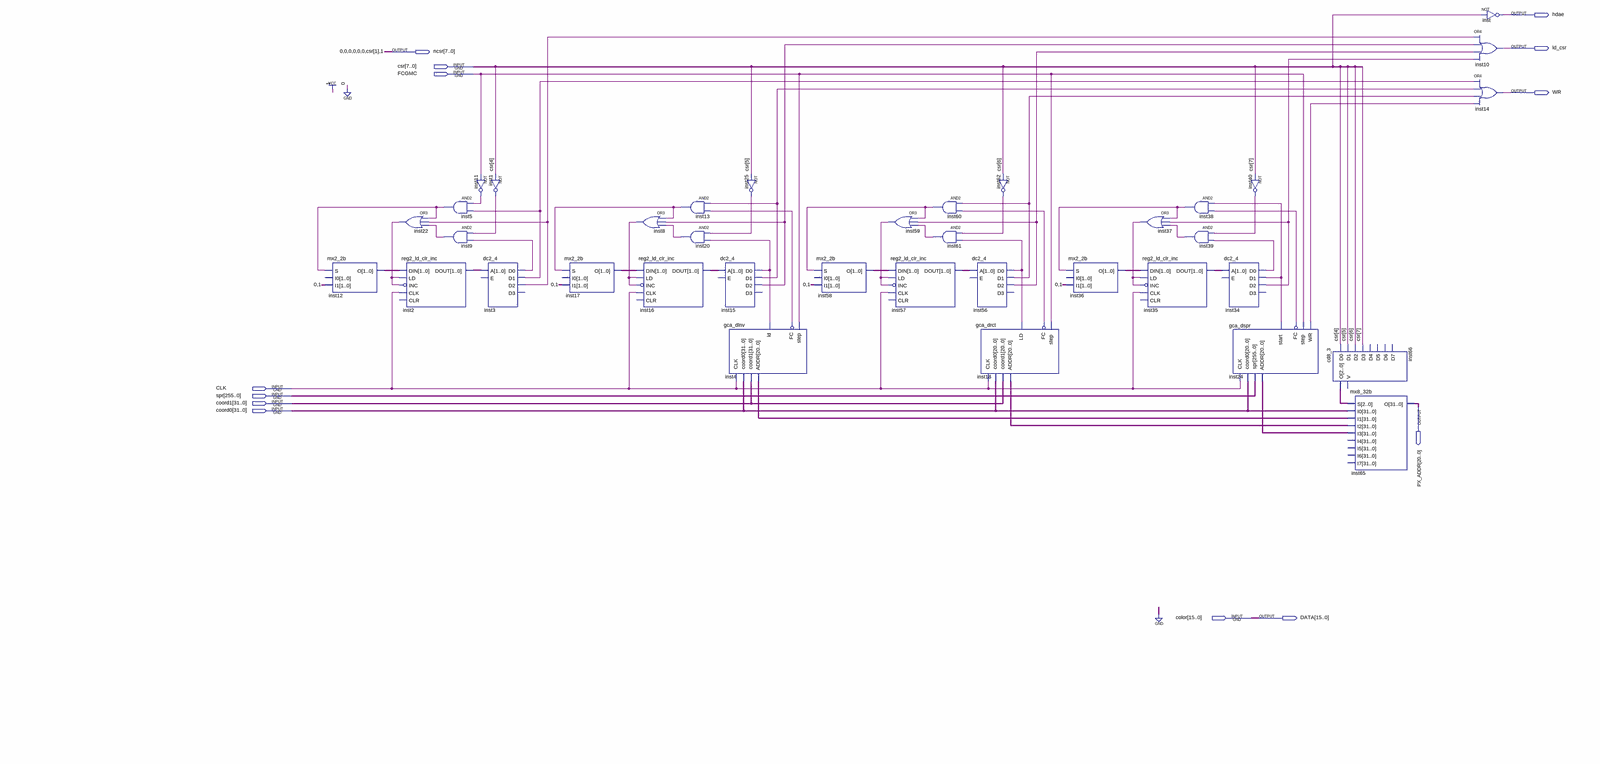
[diagram p0: schematic sheet, whole]
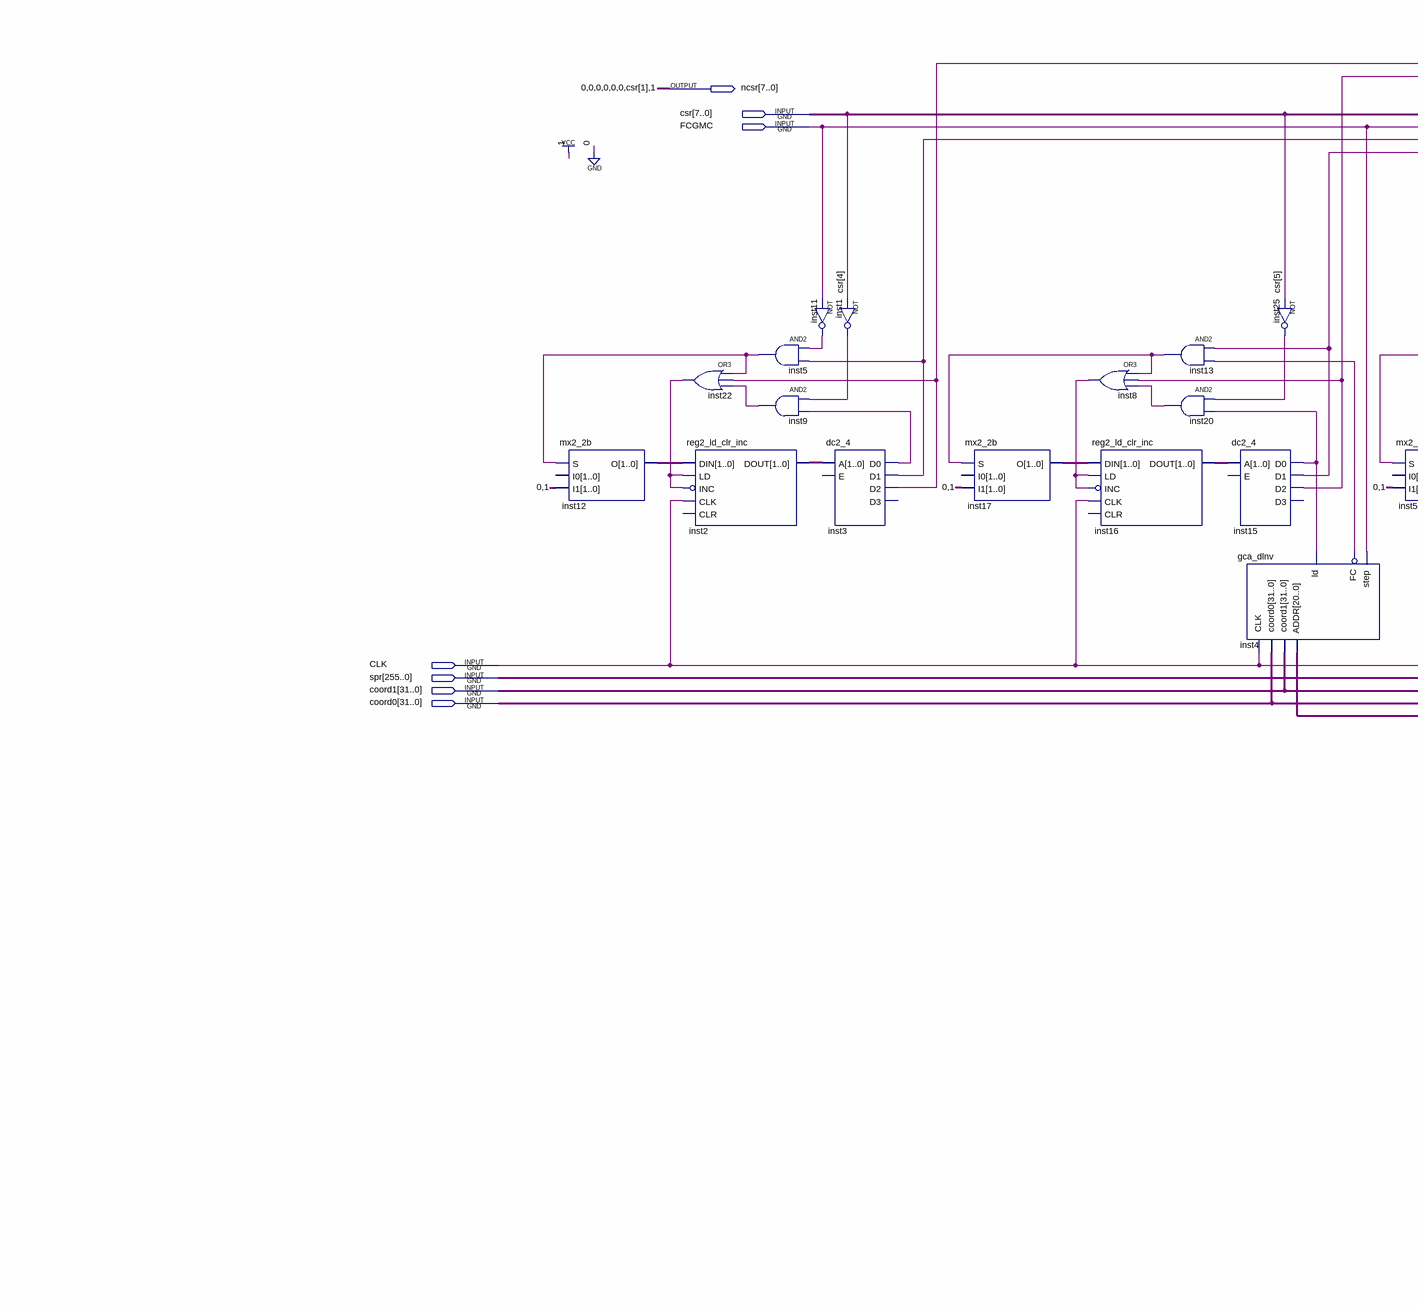
[diagram p1: schematic sheet, left part]
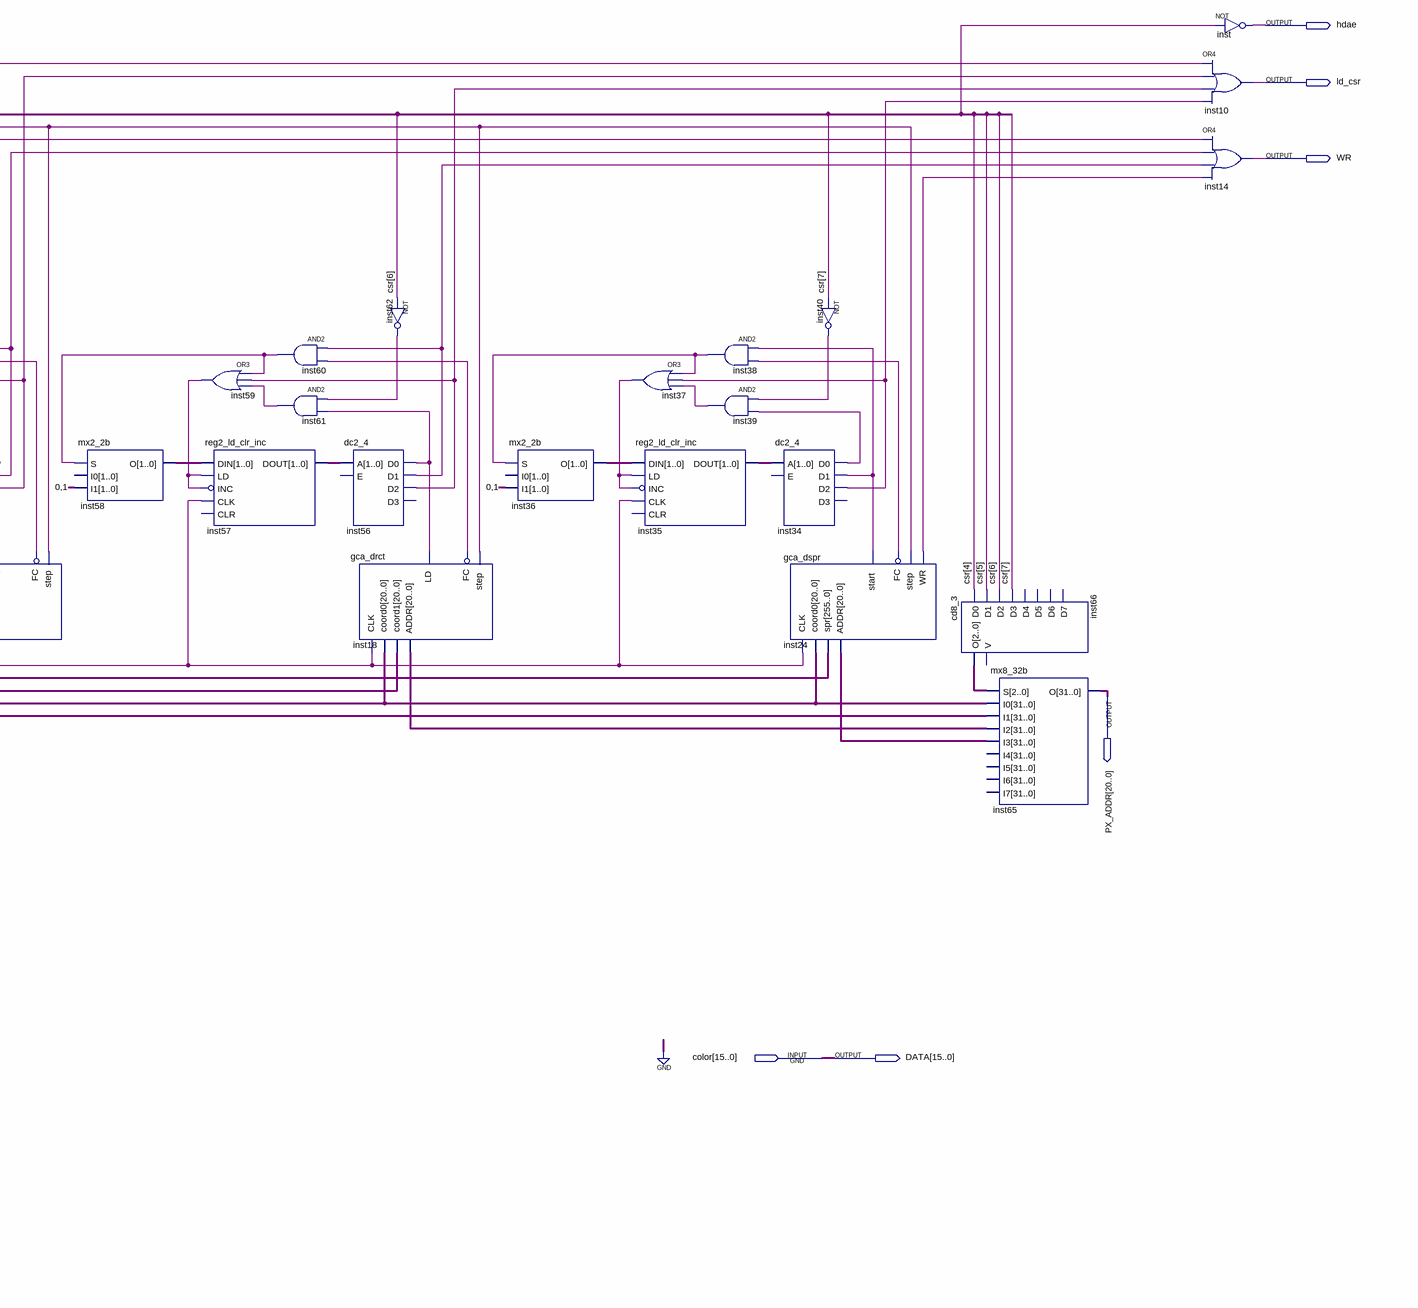
[diagram p2: schematic sheet, right part]
// Quartus schematic gca.bdf as structural Verilog: 37 symbols, 13 pins
module gca (
  input  [7:0] csr,
  input  FCGMC,
  input  CLK,
  input  [255:0] spr,
  input  [31:0] coord1,
  input  [31:0] coord0,
  input  [15:0] color,
  output hdae,
  output ld_csr,
  output [7:0] ncsr,
  output WR,
  output [31:0] PX_ADDR,
  output [15:0] DATA
);

  wire inst1_out, inst3_d0, inst3_d1, inst3_d2, inst4_fc, inst4_FC_inverted_out, inst5_out, inst8_out,
       inst9_out, inst11_out, inst13_out, inst15_d0, inst15_d1, inst15_d2, inst18_fc, inst18_FC_inverted_out,
       inst20_out, inst22_out, inst24_fc, inst24_FC_inverted_out, inst24_wr, inst25_out, inst34_d0,
       inst34_d1, inst34_d2, inst37_out, inst38_out, inst39_out, inst40_out, inst56_d0, inst56_d1, inst56_d2,
       inst59_out, inst60_out, inst61_out, inst62_out;
  wire [1:0] inst2_dout, inst12_o, inst16_dout, inst17_o, inst35_dout, inst36_o, inst57_dout, inst58_o;
  wire [2:0] inst66_o;
  wire [20:0] px_addr_1, px_addr_5, px_addr_6;

  mx2_2b inst12 (.S(inst5_out), .I1(2'b01), .O(inst12_o));  // open: I0
  or inst22 (inst22_out, inst5_out, inst3_d2, inst9_out);
  reg2_ld_clr_inc inst2 (
    .CLK(CLK), .DIN(inst12_o), .INC(~inst22_out), .LD(inst22_out), .DOUT(inst2_dout));  // open: CLR
  and inst5 (inst5_out, inst11_out, inst3_d1);
  and inst9 (inst9_out, inst1_out, inst3_d0);
  not inst11 (inst11_out, FCGMC);
  dc2_4 inst3 (.A(inst2_dout), .D0(inst3_d0), .D1(inst3_d1), .D2(inst3_d2));  // open: E, D3
  not inst1 (inst1_out, csr[4]);
  mx2_2b inst17 (.S(inst13_out), .I1(2'b01), .O(inst17_o));  // open: I0
  or inst8 (inst8_out, inst13_out, inst15_d2, inst20_out);
  reg2_ld_clr_inc inst16 (
    .CLK(CLK), .DIN(inst17_o), .INC(~inst8_out), .LD(inst8_out), .DOUT(inst16_dout));  // open: CLR
  and inst13 (inst13_out, inst15_d1, inst4_FC_inverted_out);
  and inst20 (inst20_out, inst25_out, inst15_d0);
  dc2_4 inst15 (.A(inst16_dout), .D0(inst15_d0), .D1(inst15_d1), .D2(inst15_d2));  // open: E, D3
  gca_dlnv inst4 (
    .CLK(CLK), .coord0(coord0), .coord1(coord1), .ld(inst15_d0), .step(FCGMC), .ADDR(px_addr_1), .FC(inst4_fc));
  not inst4_FC_inverted (inst4_FC_inverted_out, inst4_fc);
  not inst25 (inst25_out, csr[5]);
  mx2_2b inst58 (.S(inst60_out), .I1(2'b01), .O(inst58_o));  // open: I0
  or inst59 (inst59_out, inst60_out, inst56_d2, inst61_out);
  reg2_ld_clr_inc inst57 (
    .CLK(CLK), .DIN(inst58_o), .INC(~inst59_out), .LD(inst59_out), .DOUT(inst57_dout));  // open: CLR
  and inst60 (inst60_out, inst56_d1, inst18_FC_inverted_out);
  and inst61 (inst61_out, inst62_out, inst56_d0);
  dc2_4 inst56 (.A(inst57_dout), .D0(inst56_d0), .D1(inst56_d1), .D2(inst56_d2));  // open: E, D3
  gca_drct inst18 (
    .step(FCGMC), .coord0(coord0[20:0]), .LD(inst56_d0), .CLK(CLK), .coord1(coord1[20:0]), .ADDR(px_addr_5),
    .FC(inst18_fc));
  not inst18_FC_inverted (inst18_FC_inverted_out, inst18_fc);
  not inst62 (inst62_out, csr[6]);
  mx2_2b inst36 (.S(inst38_out), .I1(2'b01), .O(inst36_o));  // open: I0
  or inst37 (inst37_out, inst38_out, inst34_d2, inst39_out);
  reg2_ld_clr_inc inst35 (
    .CLK(CLK), .DIN(inst36_o), .INC(~inst37_out), .LD(inst37_out), .DOUT(inst35_dout));  // open: CLR
  and inst38 (inst38_out, inst34_d1, inst24_FC_inverted_out);
  and inst39 (inst39_out, inst40_out, inst34_d0);
  dc2_4 inst34 (.A(inst35_dout), .D0(inst34_d0), .D1(inst34_d1), .D2(inst34_d2));  // open: E, D3
  gca_dspr inst24 (
    .CLK(CLK), .coord0(coord0[20:0]), .spr(spr), .start(inst34_d1), .step(FCGMC), .ADDR(px_addr_6),
    .FC(inst24_fc), .WR(inst24_wr));
  not inst24_FC_inverted (inst24_FC_inverted_out, inst24_fc);
  not inst40 (inst40_out, csr[7]);
  cd8_3 inst66 (.D0(csr[4]), .D1(csr[5]), .D2(csr[6]), .D3(csr[7]), .O(inst66_o));  // open: D4, D5, D6, D7, V
  mx8_32b inst65 (
    .S(inst66_o), .I0(coord0), .I1({{11{1'b0}}, px_addr_1}), .I2({{11{1'b0}}, px_addr_5}),
    .I3({{11{1'b0}}, px_addr_6}), .O(PX_ADDR));  // open: I4, I5, I6, I7
  not inst (hdae, csr[1]);
  or inst10 (ld_csr, inst3_d2, inst15_d2, inst56_d2, inst34_d2);
  or inst14 (WR, inst3_d1, inst15_d1, inst56_d1, inst24_wr);

  assign DATA = color;
  assign ncsr = {{6{1'b0}}, csr[1], 1'b1};
endmodule
